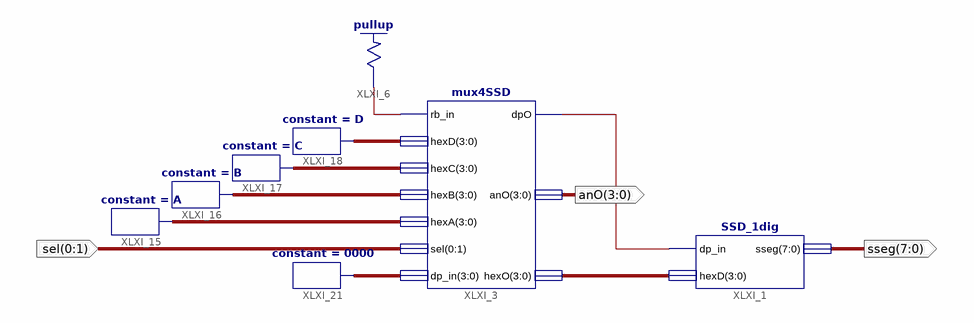
[diagram p0: schematic sheet 1]
// Xilinx ISE schematic Lab6Exp2.sch (spartan3e) as structural Verilog: 8 symbols, 3 ports
module Lab6Exp2 (
  input  [0:1] sel,
  output [3:0] anO,
  output [7:0] sseg
);

  wire XLXN_8, XLXN_22;
  wire [3:0] XLXN_5, XLXN_18, XLXN_19, XLXN_20, XLXN_21, XLXN_25;

  SSD_1dig XLXI_1 (.dp_in(XLXN_22), .hexD(XLXN_5), .sseg(sseg));
  mux4SSD XLXI_3 (
    .rb_in(XLXN_8), .hexD(XLXN_21), .hexC(XLXN_20), .hexB(XLXN_19), .hexA(XLXN_18), .sel(sel),
    .dp_in(XLXN_25), .dpO(XLXN_22), .anO(anO), .hexO(XLXN_5));
  \pullup  XLXI_6 (.O(XLXN_8));
  constant #(.CValue("A")) XLXI_15 (.O(XLXN_18));
  constant #(.CValue("B")) XLXI_16 (.O(XLXN_19));
  constant #(.CValue("C")) XLXI_17 (.O(XLXN_20));
  constant #(.CValue("D")) XLXI_18 (.O(XLXN_21));
  constant #(.CValue("0000")) XLXI_21 (.O(XLXN_25));
endmodule
